# Altium schematic sheet Doorbellv1.2.SchDoc
size A4; SheetNumber: 2; SheetTotal: 3
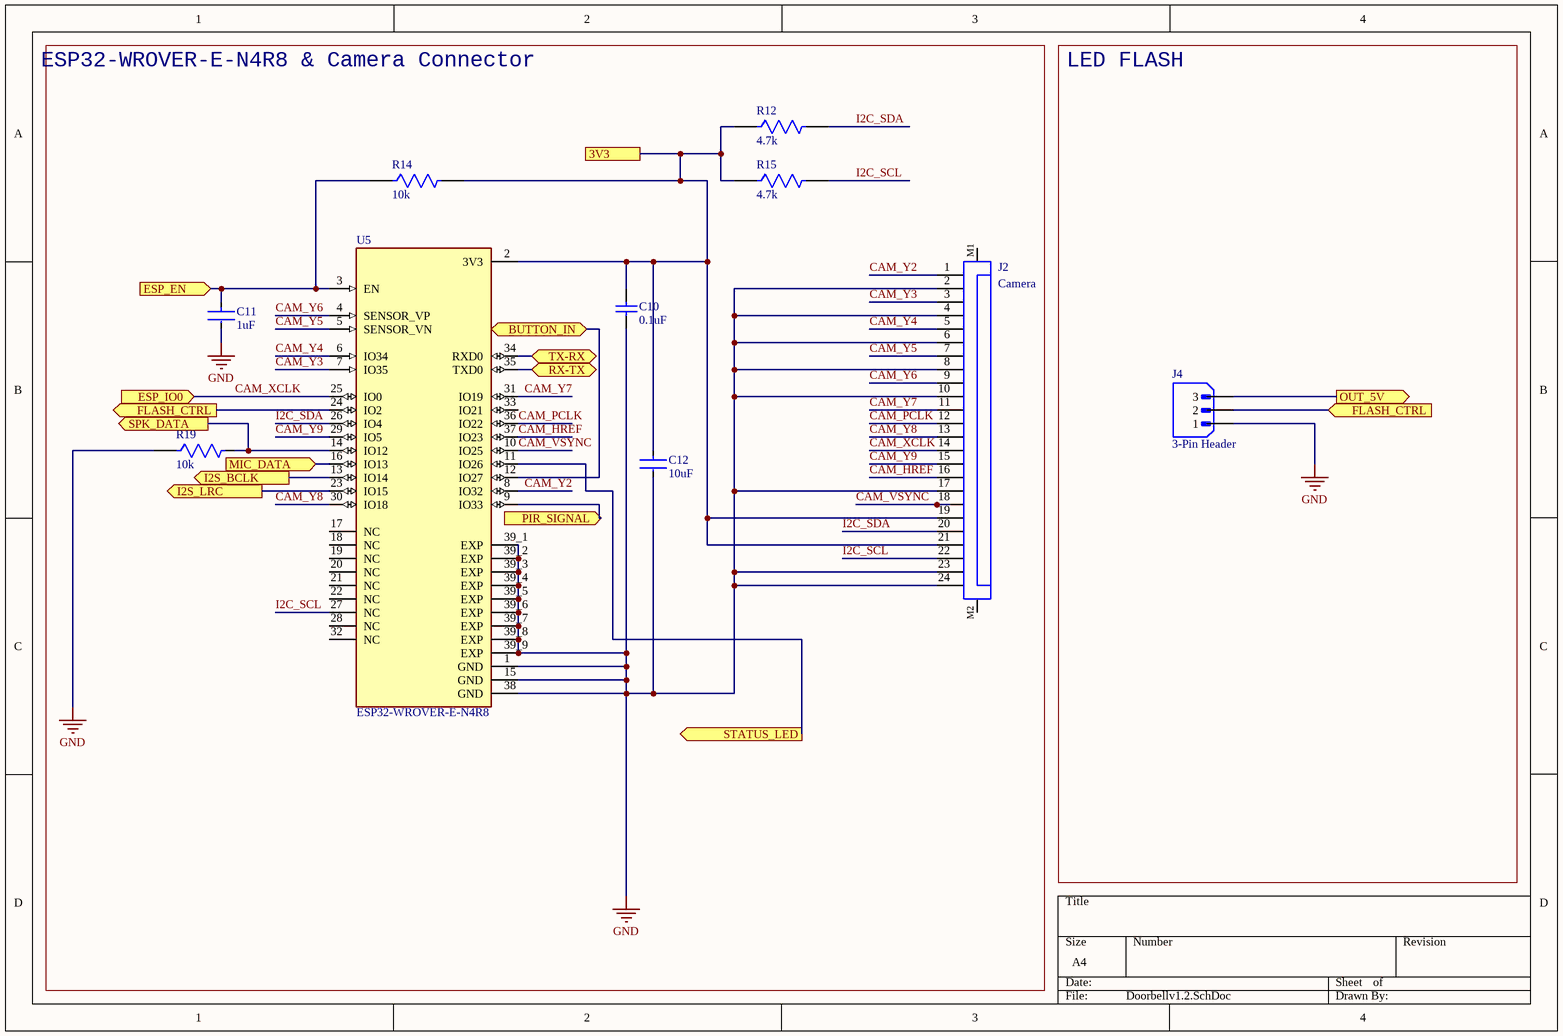
[diagram p0: Doorbellv1.2.SchDoc]

## Parts
C10  0.1uF  [CAPC1608X90X35NL15T15]
C11  1uF  [FP-CC0603-DA-MFG]
C12  10uF  [FP-C0603C106M8PACTU-MFG]
J2  Camera  [68712414522]
J4  3-Pin Header  [JST_B3B-XH-A]
R12  4.7k  [FP-TFCR0603-IPC_B]
R14  10k  [FP-MCT0603-IPC_B]
R15  4.7k  [FP-TFCR0603-IPC_B]
R19  10k  [FP-MCT0603-IPC_B]
U5  ESP32-WROVER-E-N4R8  [XCVR_ESP32-WROVER-E-N4R8]

## Blocks framed on the sheet
ESP32-WROVER-E-N4R8 & Camera Connector: C10-C12 J2 R12 R14 R15 R19 U5
LED FLASH: J4

## Ports
3V3 (see Doorbellv1.1[3C], Doorbellv1.3[1A]), BUTTON_IN (bidir, see Doorbellv1.3[3C]), ESP_EN (in, see Doorbellv1.1[4C]), ESP_IO0 (in, see Doorbellv1.1[4C]), FLASH_CTRL (in, see Doorbellv1.2[1B]), FLASH_CTRL (out, see Doorbellv1.2[4B]), I2S_BCLK (out, see Doorbellv1.3[2B], Doorbellv1.3[3A]), I2S_LRC (out, see Doorbellv1.3[2B], Doorbellv1.3[3A]), MIC_DATA (in, see Doorbellv1.3[2B]), OUT_5V (out, see Doorbellv1.1[3C], Doorbellv1.1[4B], Doorbellv1.3[1C], Doorbellv1.3[3B], Doorbellv1.3[4A]), PIR_SIGNAL (in, see Doorbellv1.3[1C]), RX-TX (bidir, see Doorbellv1.1[3C]), SPK_DATA (out, see Doorbellv1.3[3A]), STATUS_LED (out, see Doorbellv1.3[2C]), TX-RX (bidir, see Doorbellv1.1[3C])

## Nets
GND: C10.2 C11.2 C12.2 J2.2 J2.4 J2.6 J2.8 J2.10 J2.17 J2.23 J2.24 J4.1 R19.1 U5.1(GND) U5.15(GND) U5.38(GND) U5.39_1(EXP) U5.39_2(EXP) U5.39_3(EXP) U5.39_4(EXP) U5.39_5(EXP) U5.39_6(EXP) U5.39_7(EXP) U5.39_8(EXP) U5.39_9(EXP)
3V3: C10.1 C12.1 J2.19 J2.21 R12.1 R14.2 R15.1 U5.2(3V3) ; port 3V3
BUTTON_IN: U5.12(IO27) ; port BUTTON_IN
CAM_HREF: J2.16 U5.37(IO23)
CAM_PCLK: J2.12 U5.36(IO22)
CAM_VSYNC: J2.18 U5.10(IO25)
CAM_XCLK: J2.14 U5.25(IO0) ; port ESP_IO0
CAM_Y2: J2.1 U5.8(IO32)
CAM_Y3: J2.3 U5.7(IO35)
CAM_Y4: J2.5 U5.6(IO34)
CAM_Y5: J2.7 U5.5(SENSOR_VN)
CAM_Y6: J2.9 U5.4(SENSOR_VP)
CAM_Y7: J2.11 U5.31(IO19)
CAM_Y8: J2.13 U5.30(IO18)
CAM_Y9: J2.15 U5.29(IO5)
ESP_EN: C11.1 R14.1 U5.3(EN) ; port ESP_EN
FLASH_CTRL: J4.2 U5.24(IO2) ; port FLASH_CTRL
I2C_SCL: J2.22 R15.2 U5.27(NC)
I2C_SDA: J2.20 R12.2 U5.26(IO4)
I2S_BCLK: U5.13(IO14) ; port I2S_BCLK
I2S_LRC: U5.23(IO15) ; port I2S_LRC
MIC_DATA: U5.16(IO13) ; port MIC_DATA
OUT_5V: J4.3 ; port OUT_5V
PIR_SIGNAL: U5.9(IO33) ; port PIR_SIGNAL
RX-TX: U5.35(TXD0) ; port RX-TX
SPK_DATA: R19.2 U5.14(IO12) ; port SPK_DATA
STATUS_LED: U5.11(IO26) ; port STATUS_LED
TX-RX: U5.34(RXD0) ; port TX-RX

Not connected (* = marked no-connect by the designer): J2 M1 M2; U5 17(NC) 18(NC) 19(NC) 20(NC) 21(NC) 22(NC) 28(NC) 32(NC) 33(IO21)

## Library data of the parts
C10 = CMP-2006-02299-1: Part Number: C0603C104K4RAC7013; Manufacturer: Kemet
C11 = CMP-03422-000857-1: CAP CER 1UF 25V X5R 0603; Manufacturer: YAGEO; Manufacturer Part Number: CC0603MRX5R8BB105; Tolerance: 0.2; Material: Ceramic; Temperature Coefficient: 15%; Octopart: https://octopart.com/cc0603mrx5r8bb105-yageo-57080766; Temperature Characteristic: X5R; Device Class L3: Ceramic Capacitors; Device Class L2: Capacitors; Device Class L1: Passive Components; Voltage: 25 V; ComponentLink2URL: http://www.yageo.com/documents/recent/UPY-GPHC_X7R_6.3V-to-50V_18.pdf; Temperature Range High: +125°C; Height: 0.9mm; Digikey Description: CAP CER 1UF 25V X5R 0603; Category: Cap; Temperature Range Low: -55°C; Footprint Url: http://www.yageo.com/exep/pages/download/literatures/UPY-C_GEN_24.pdf; Automotive: No; Package: CC0603-DA; Lead Free: Yes; ComponentLink2Description: Datasheet; Value: 1 uF; RoHS: TRUE; Voltage Rating: 25 V; Capacitance: 1 uF; Temperature: -55°C to +125°C
C12 = CMP-03020-034654-1: CAP CER 10UF 10V X5R 0603; RoHS Compliant: Yes
J2 = CMP-1502-01537-3: Ffc/fpc Conn, R/a Rcpt, 24POS, 1ROW, SMT Rohs Compliant: Yes; Operating Supply Voltage: 50V; Pitch: 500µm; Number of Positions: 24; Insulation Resistance: 100MΩ; Contact Location: Top; Contact Resistance: 20mΩ; Gender: Receptacle; Current Rating: 500mA; Actuator Material: Liquid Crystal Polymer, Polymer; Number of Pins: 24; RoHS: Compliant; Length: 12.6mm; Number of Rows: 1; Mount: Surface Mount; Contact Plating: Tin; Flammability Rating: UL94 V-0; REACH SVHC: Unknown; Voltage Rating: 50V; Lead Pitch: 500µm; Number of Contacts: 24; Packaging: Tape and Reel; Max Operating Temperature: 85°C; Width: 2.1mm; Contact Material: Bronze, Tin; Housing Material: Liquid Crystal Polymer; Min Operating Temperature: -25°C; Termination: SMD/SMT; Orientation: Horizontal
J4 = B3B-XH-A: Connector Header Through Hole 3 position 0.098 (2.50mm); MF: JST Sales; SnapEDA_Link: https://www.snapeda.com/parts/B3B-XH-A/JST+Sales+America+Inc./view-part/?ref=snap; Package: None; Value: *; MP: B3B-XH-A; Check_prices: https://www.snapeda.com/parts/B3B-XH-A/JST+Sales+America+Inc./view-part/?ref=eda
R12 R15 = CMP-250906-287647-1: RES Thin Film,  4.7kΩ, 1%, 0.1W, 50ppm/°C, 0603
R14 R19 = CMP-02407-001090-1: RES SMD 100 OHM 1% 1/8W 0603
U5 = ESP32-WROVER-E-N4R8: Bluetooth, WiFi 802.11b/g/n, Bluetooth v4.2 +EDR Transceiver Module 2.4GHz ~ 2.5GHz PCB Trace Surface Mount; MF: Espressif Systems; SnapEDA_Link: https://www.snapeda.com/parts/ESP32-WROVER-E-N4R8/Espressif+Systems/view-part/?ref=snap; Package: SMD-38 Espressif Systems; Value: *; MP: ESP32-WROVER-E-N4R8; Check_prices: https://www.snapeda.com/parts/ESP32-WROVER-E-N4R8/Espressif+Systems/view-part/?ref=eda